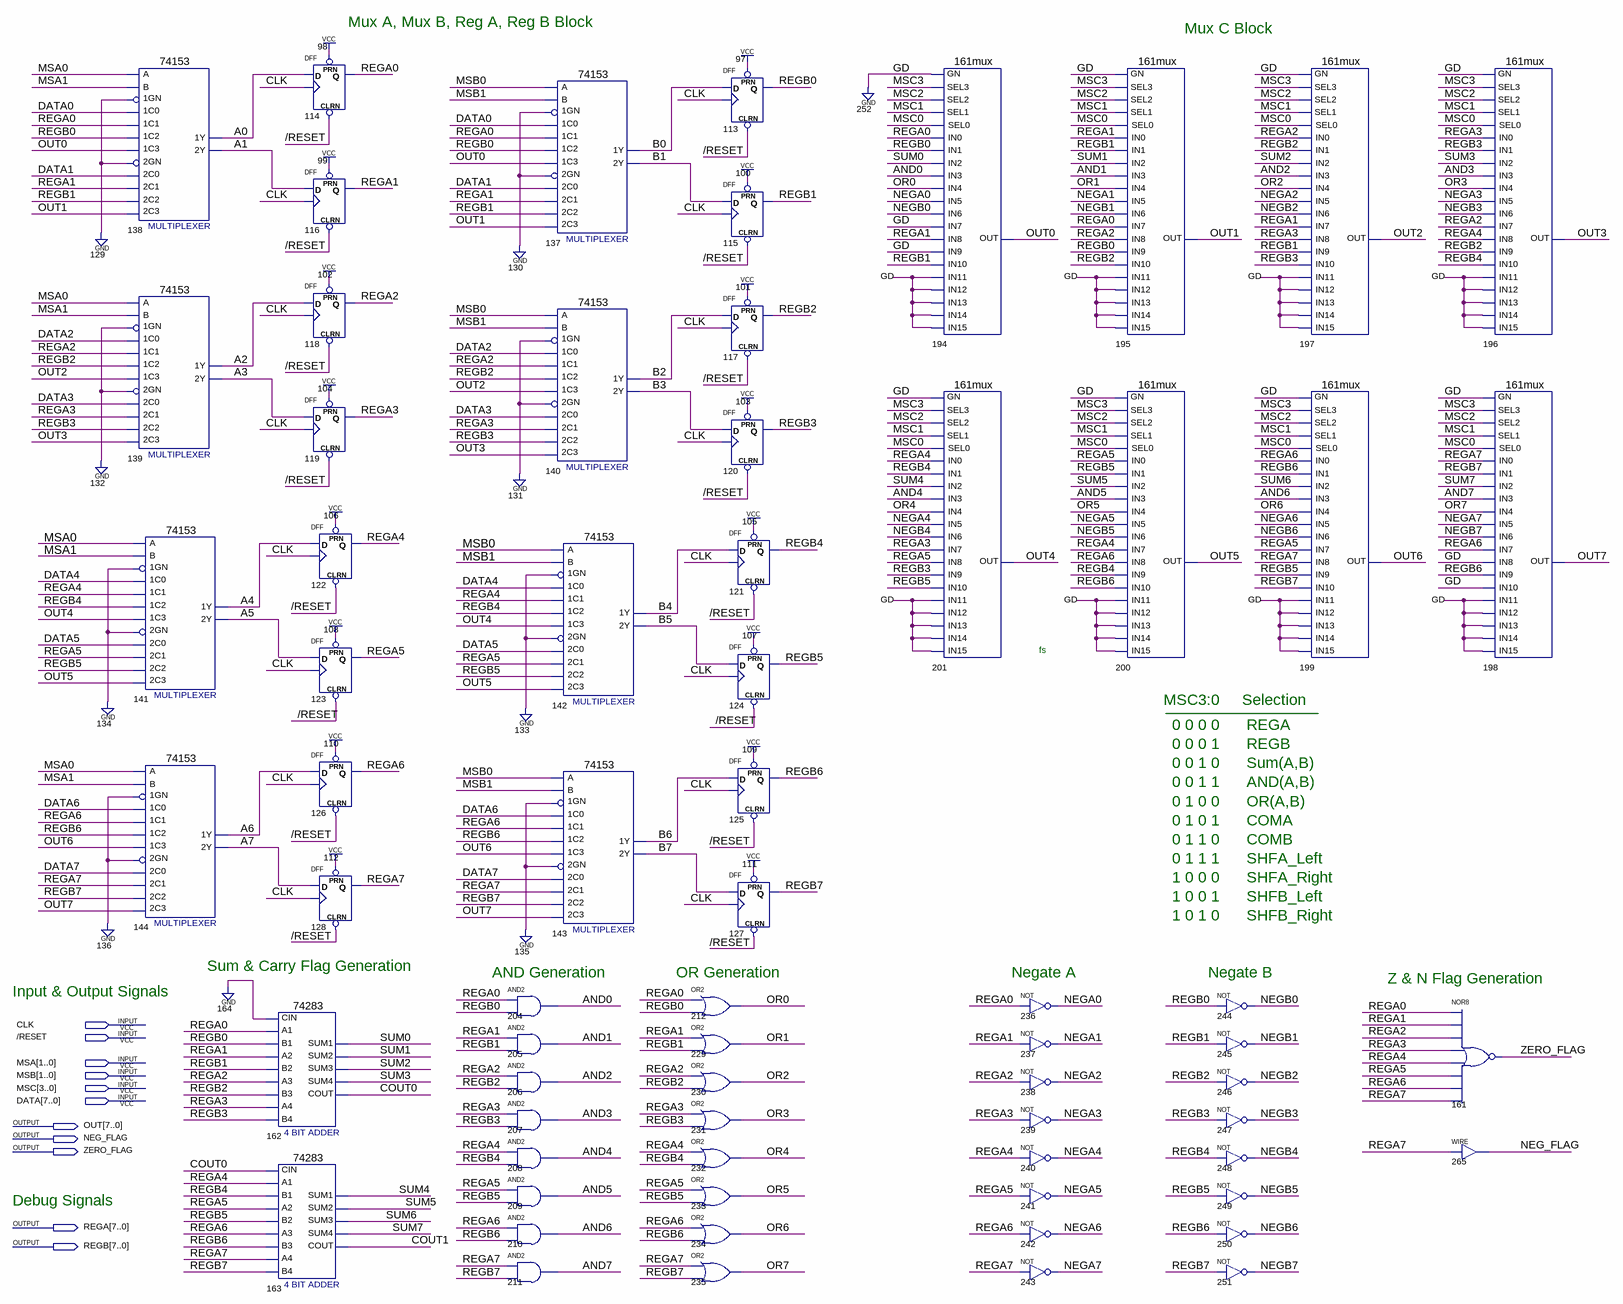
[diagram p0: schematic sheet]
// Quartus schematic alu.bdf as structural Verilog: 68 symbols, 11 pins
module alu (
  input  CLK,
  input  \/RESET ,
  input  [1:0] MSA,
  input  [1:0] MSB,
  input  [3:0] MSC,
  input  [7:0] DATA,
  output [7:0] OUT,
  output NEG_FLAG,
  output ZERO_FLAG,
  output [7:0] REGA,
  output [7:0] REGB
);

  wire A0, A1, A2, A3, A4, A5, A6, A7, AND0, AND1, AND2, AND3, AND4, AND5, AND6, AND7, B0, B1, B2, B3, B4,
       B5, B6, B7, COUT0, COUT1, NEGA0, NEGA1, NEGA2, NEGA3, NEGA4, NEGA5, NEGA6, NEGA7, NEGB0, NEGB1, NEGB2,
       NEGB3, NEGB4, NEGB5, NEGB6, NEGB7, OR0, OR1, OR2, OR3, OR4, OR5, OR6, OR7, SUM0, SUM1, SUM2, SUM3,
       SUM4, SUM5, SUM6, SUM7;

  \74153  u_138 (
    .\1C1 (REGA[0]), .\1C0 (DATA[0]), .\1GN (1'b0), .\2C0 (DATA[1]), .\2GN (1'b0), .\1C3 (OUT[0]),
    .\1C2 (REGB[0]), .\2C2 (REGB[1]), .\2C1 (REGA[1]), .A(MSA[0]), .B(MSA[1]), .\2C3 (OUT[1]), .\2Y (A1),
    .\1Y (A0));
  \74153  u_139 (
    .\1C1 (REGA[2]), .\1C0 (DATA[2]), .\1GN (1'b0), .\2C0 (DATA[3]), .\2GN (1'b0), .\1C3 (OUT[2]),
    .\1C2 (REGB[2]), .\2C2 (REGB[3]), .\2C1 (REGA[3]), .A(MSA[0]), .B(MSA[1]), .\2C3 (OUT[3]), .\2Y (A3),
    .\1Y (A2));
  \74153  u_141 (
    .\1C1 (REGA[4]), .\1C0 (DATA[4]), .\1GN (1'b0), .\2C0 (DATA[5]), .\2GN (1'b0), .\1C3 (OUT[4]),
    .\1C2 (REGB[4]), .\2C2 (REGB[5]), .\2C1 (REGA[5]), .A(MSA[0]), .B(MSA[1]), .\2C3 (OUT[5]), .\2Y (A5),
    .\1Y (A4));
  \74153  u_144 (
    .\1C1 (REGA[6]), .\1C0 (DATA[6]), .\1GN (1'b0), .\2C0 (DATA[7]), .\2GN (1'b0), .\1C3 (OUT[6]),
    .\1C2 (REGB[6]), .\2C2 (REGB[7]), .\2C1 (REGA[7]), .A(MSA[0]), .B(MSA[1]), .\2C3 (OUT[7]), .\2Y (A7),
    .\1Y (A6));
  \74283  u_162 (
    .A1(REGA[0]), .CIN(1'b0), .A3(REGA[2]), .B2(REGB[1]), .A2(REGA[1]), .B1(REGB[0]), .B4(REGB[3]),
    .A4(REGA[3]), .B3(REGB[2]), .COUT(COUT0), .SUM4(SUM3), .SUM3(SUM2), .SUM2(SUM1), .SUM1(SUM0));
  \74283  u_163 (
    .A1(REGA[4]), .CIN(COUT0), .A3(REGA[6]), .B2(REGB[5]), .A2(REGA[5]), .B1(REGB[4]), .B4(REGB[7]),
    .A4(REGA[7]), .B3(REGB[6]), .COUT(COUT1), .SUM4(SUM7), .SUM3(SUM6), .SUM2(SUM5), .SUM1(SUM4));
  DFF u_114 (.CLRN(\/RESET ), .CLK(CLK), .D(A0), .PRN(1'b1), .Q(REGA[0]));
  DFF u_116 (.CLRN(\/RESET ), .CLK(CLK), .D(A1), .PRN(1'b1), .Q(REGA[1]));
  DFF u_118 (.CLRN(\/RESET ), .CLK(CLK), .D(A2), .PRN(1'b1), .Q(REGA[2]));
  DFF u_119 (.CLRN(\/RESET ), .CLK(CLK), .D(A3), .PRN(1'b1), .Q(REGA[3]));
  DFF u_122 (.CLRN(\/RESET ), .CLK(CLK), .D(A4), .PRN(1'b1), .Q(REGA[4]));
  DFF u_123 (.CLRN(\/RESET ), .CLK(CLK), .D(A5), .PRN(1'b1), .Q(REGA[5]));
  DFF u_126 (.CLRN(\/RESET ), .CLK(CLK), .D(A6), .PRN(1'b1), .Q(REGA[6]));
  DFF u_128 (.CLRN(\/RESET ), .CLK(CLK), .D(A7), .PRN(1'b1), .Q(REGA[7]));
  and u_204 (AND0, REGA[0], REGB[0]);
  and u_205 (AND1, REGA[1], REGB[1]);
  and u_206 (AND2, REGA[2], REGB[2]);
  and u_207 (AND3, REGA[3], REGB[3]);
  and u_208 (AND4, REGA[4], REGB[4]);
  and u_209 (AND5, REGA[5], REGB[5]);
  and u_210 (AND6, REGA[6], REGB[6]);
  and u_211 (AND7, REGA[7], REGB[7]);
  \74153  u_137 (
    .\1C1 (REGA[0]), .\1C0 (DATA[0]), .\1GN (1'b0), .\2C0 (DATA[1]), .\2GN (1'b0), .\1C3 (OUT[0]),
    .\1C2 (REGB[0]), .\2C2 (REGB[1]), .\2C1 (REGA[1]), .A(MSB[0]), .B(MSB[1]), .\2C3 (OUT[1]), .\2Y (B1),
    .\1Y (B0));
  \74153  u_140 (
    .\1C1 (REGA[2]), .\1C0 (DATA[2]), .\1GN (1'b0), .\2C0 (DATA[3]), .\2GN (1'b0), .\1C3 (OUT[2]),
    .\1C2 (REGB[2]), .\2C2 (REGB[3]), .\2C1 (REGA[3]), .A(MSB[0]), .B(MSB[1]), .\2C3 (OUT[3]), .\2Y (B3),
    .\1Y (B2));
  \74153  u_142 (
    .\1C1 (REGA[4]), .\1C0 (DATA[4]), .\1GN (1'b0), .\2C0 (DATA[5]), .\2GN (1'b0), .\1C3 (OUT[4]),
    .\1C2 (REGB[4]), .\2C2 (REGB[5]), .\2C1 (REGA[5]), .A(MSB[0]), .B(MSB[1]), .\2C3 (OUT[5]), .\2Y (B5),
    .\1Y (B4));
  \74153  u_143 (
    .\1C1 (REGA[6]), .\1C0 (DATA[6]), .\1GN (1'b0), .\2C0 (DATA[7]), .\2GN (1'b0), .\1C3 (OUT[6]),
    .\1C2 (REGB[6]), .\2C2 (REGB[7]), .\2C1 (REGA[7]), .A(MSB[0]), .B(MSB[1]), .\2C3 (OUT[7]), .\2Y (B7),
    .\1Y (B6));
  DFF u_113 (.CLRN(\/RESET ), .CLK(CLK), .D(B0), .PRN(1'b1), .Q(REGB[0]));
  DFF u_115 (.CLRN(\/RESET ), .CLK(CLK), .D(B1), .PRN(1'b1), .Q(REGB[1]));
  DFF u_117 (.CLRN(\/RESET ), .CLK(CLK), .D(B2), .PRN(1'b1), .Q(REGB[2]));
  DFF u_120 (.CLRN(\/RESET ), .CLK(CLK), .D(B3), .PRN(1'b1), .Q(REGB[3]));
  DFF u_121 (.CLRN(\/RESET ), .CLK(CLK), .D(B4), .PRN(1'b1), .Q(REGB[4]));
  DFF u_124 (.CLRN(\/RESET ), .CLK(CLK), .D(B5), .PRN(1'b1), .Q(REGB[5]));
  DFF u_125 (.CLRN(\/RESET ), .CLK(CLK), .D(B6), .PRN(1'b1), .Q(REGB[6]));
  DFF u_127 (.CLRN(\/RESET ), .CLK(CLK), .D(B7), .PRN(1'b1), .Q(REGB[7]));
  or u_212 (OR0, REGA[0], REGB[0]);
  or u_229 (OR1, REGA[1], REGB[1]);
  or u_230 (OR2, REGA[2], REGB[2]);
  or u_231 (OR3, REGA[3], REGB[3]);
  or u_232 (OR4, REGA[4], REGB[4]);
  or u_233 (OR5, REGA[5], REGB[5]);
  or u_234 (OR6, REGA[6], REGB[6]);
  or u_235 (OR7, REGA[7], REGB[7]);
  \161mux  u_194 (
    .SEL3(MSC[3]), .GN(1'b0), .SEL0(MSC[0]), .IN0(REGA[0]), .SEL1(MSC[1]), .SEL2(MSC[2]), .IN1(REGB[0]),
    .IN2(SUM0), .IN3(AND0), .IN4(OR0), .IN5(NEGA0), .IN6(NEGB0), .IN7(1'b0), .IN8(REGA[1]), .IN9(1'b0),
    .IN10(REGB[1]), .IN11(1'b0), .IN12(1'b0), .IN13(1'b0), .IN14(1'b0), .IN15(1'b0), .OUT(OUT[0]));
  \161mux  u_201 (
    .SEL3(MSC[3]), .GN(1'b0), .SEL0(MSC[0]), .IN0(REGA[4]), .SEL1(MSC[1]), .SEL2(MSC[2]), .IN1(REGB[4]),
    .IN2(SUM4), .IN3(AND4), .IN4(OR4), .IN5(NEGA4), .IN6(NEGB4), .IN7(REGA[3]), .IN8(REGA[5]), .IN9(REGB[3]),
    .IN10(REGB[5]), .IN11(1'b0), .IN12(1'b0), .IN13(1'b0), .IN14(1'b0), .IN15(1'b0), .OUT(OUT[4]));
  not u_236 (NEGA0, REGA[0]);
  not u_237 (NEGA1, REGA[1]);
  not u_238 (NEGA2, REGA[2]);
  not u_239 (NEGA3, REGA[3]);
  not u_240 (NEGA4, REGA[4]);
  not u_241 (NEGA5, REGA[5]);
  not u_242 (NEGA6, REGA[6]);
  not u_243 (NEGA7, REGA[7]);
  \161mux  u_195 (
    .SEL3(MSC[3]), .GN(1'b0), .SEL0(MSC[0]), .IN0(REGA[1]), .SEL1(MSC[1]), .SEL2(MSC[2]), .IN1(REGB[1]),
    .IN2(SUM1), .IN3(AND1), .IN4(OR1), .IN5(NEGA1), .IN6(NEGB1), .IN7(REGA[0]), .IN8(REGA[2]), .IN9(REGB[0]),
    .IN10(REGB[2]), .IN11(1'b0), .IN12(1'b0), .IN13(1'b0), .IN14(1'b0), .IN15(1'b0), .OUT(OUT[1]));
  \161mux  u_200 (
    .SEL3(MSC[3]), .GN(1'b0), .SEL0(MSC[0]), .IN0(REGA[5]), .SEL1(MSC[1]), .SEL2(MSC[2]), .IN1(REGB[5]),
    .IN2(SUM5), .IN3(AND5), .IN4(OR5), .IN5(NEGA5), .IN6(NEGB5), .IN7(REGA[4]), .IN8(REGA[6]), .IN9(REGB[4]),
    .IN10(REGB[6]), .IN11(1'b0), .IN12(1'b0), .IN13(1'b0), .IN14(1'b0), .IN15(1'b0), .OUT(OUT[5]));
  not u_244 (NEGB0, REGB[0]);
  not u_245 (NEGB1, REGB[1]);
  not u_246 (NEGB2, REGB[2]);
  not u_247 (NEGB3, REGB[3]);
  not u_248 (NEGB4, REGB[4]);
  not u_249 (NEGB5, REGB[5]);
  not u_250 (NEGB6, REGB[6]);
  not u_251 (NEGB7, REGB[7]);
  \161mux  u_197 (
    .SEL3(MSC[3]), .GN(1'b0), .SEL0(MSC[0]), .IN0(REGA[2]), .SEL1(MSC[1]), .SEL2(MSC[2]), .IN1(REGB[2]),
    .IN2(SUM2), .IN3(AND2), .IN4(OR2), .IN5(NEGA2), .IN6(NEGB2), .IN7(REGA[1]), .IN8(REGA[3]), .IN9(REGB[1]),
    .IN10(REGB[3]), .IN11(1'b0), .IN12(1'b0), .IN13(1'b0), .IN14(1'b0), .IN15(1'b0), .OUT(OUT[2]));
  \161mux  u_199 (
    .SEL3(MSC[3]), .GN(1'b0), .SEL0(MSC[0]), .IN0(REGA[6]), .SEL1(MSC[1]), .SEL2(MSC[2]), .IN1(REGB[6]),
    .IN2(SUM6), .IN3(AND6), .IN4(OR6), .IN5(NEGA6), .IN6(NEGB6), .IN7(REGA[5]), .IN8(REGA[7]), .IN9(REGB[5]),
    .IN10(REGB[7]), .IN11(1'b0), .IN12(1'b0), .IN13(1'b0), .IN14(1'b0), .IN15(1'b0), .OUT(OUT[6]));
  \161mux  u_196 (
    .SEL3(MSC[3]), .GN(1'b0), .SEL0(MSC[0]), .IN0(REGA[3]), .SEL1(MSC[1]), .SEL2(MSC[2]), .IN1(REGB[3]),
    .IN2(SUM3), .IN3(AND3), .IN4(OR3), .IN5(NEGA3), .IN6(NEGB3), .IN7(REGA[2]), .IN8(REGA[4]), .IN9(REGB[2]),
    .IN10(REGB[4]), .IN11(1'b0), .IN12(1'b0), .IN13(1'b0), .IN14(1'b0), .IN15(1'b0), .OUT(OUT[3]));
  \161mux  u_198 (
    .SEL3(MSC[3]), .GN(1'b0), .SEL0(MSC[0]), .IN0(REGA[7]), .SEL1(MSC[1]), .SEL2(MSC[2]), .IN1(REGB[7]),
    .IN2(SUM7), .IN3(AND7), .IN4(OR7), .IN5(NEGA7), .IN6(NEGB7), .IN7(REGA[6]), .IN8(1'b0), .IN9(REGB[6]),
    .IN10(1'b0), .IN11(1'b0), .IN12(1'b0), .IN13(1'b0), .IN14(1'b0), .IN15(1'b0), .OUT(OUT[7]));
  nor u_161 (ZERO_FLAG, REGA[0], REGA[1], REGA[2], REGA[3], REGA[4], REGA[5], REGA[6], REGA[7]);
  assign NEG_FLAG = REGA[7];  // WIRE 265

  // Notes on the sheet:
  //   Mux A, Mux B, Reg A, Reg B Block
  //   Mux C Block
  //   fs
  //    MSC3:0     Selection
  //   __________________
  //   0 0 0 0      REGA
  //   0 0 0 1      REGB
  //   0 0 1 0      Sum(A,B)
  //   0 0 1 1      AND(A,B)
  //   0 1 0 0      OR(A,B)
  //   0 1 0 1      COMA
  //   0 1 1 0      COMB
  //   0 1 1 1      SHFA_Left
  //   1 0 0 0      SHFA_Right
  //   1 0 0 1      SHFB_Left
  //   1 0 1 0      SHFB_Right
  //    Sum & Carry Flag Generation
  //    AND Generation
  //    OR Generation
  //    Negate A
  //    Negate B
  //   Z & N Flag Generation
  //   Input & Output Signals
  //   Debug Signals
endmodule
